# Altium project Auto_OBD.PrjPCB
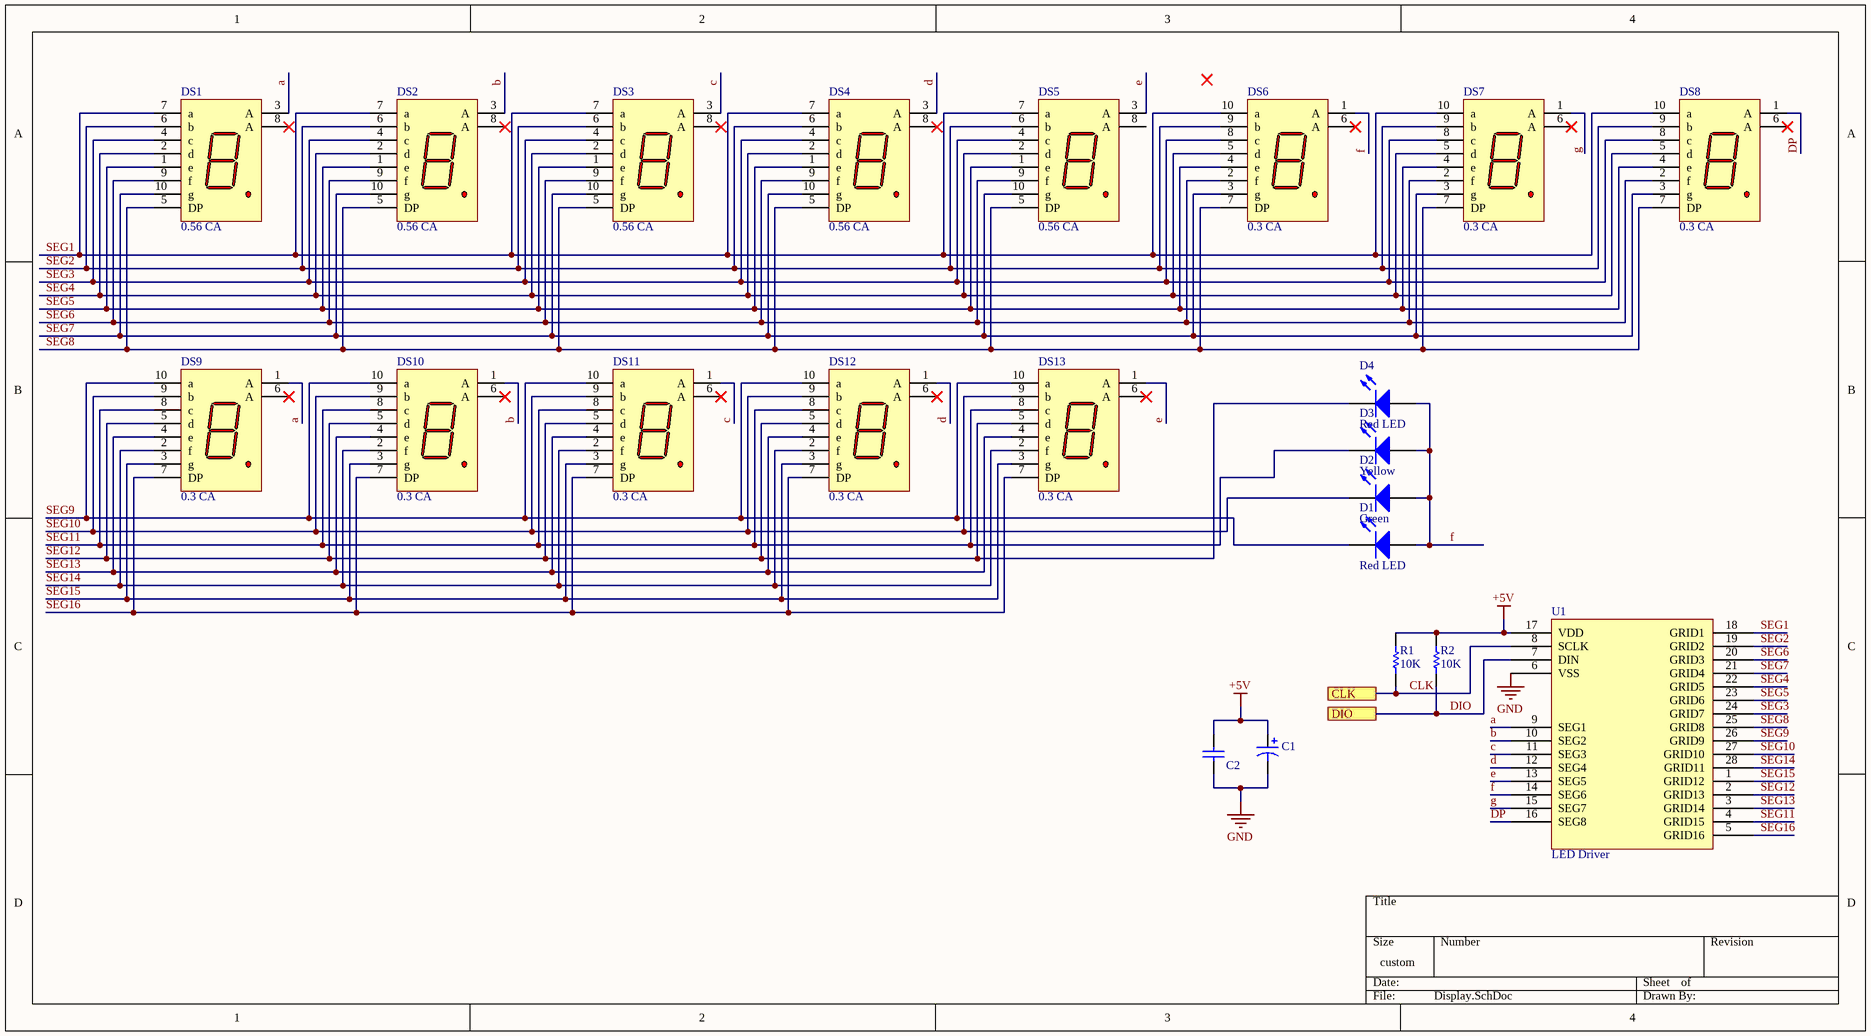
[diagram p0: Display.SchDoc]
2 sheets, 107 parts. Net scope: flat (ports and power ports of the same name join across sheets).
Board files: Auto.PcbDoc, Auto Panel.PcbDoc
Sheets:
  Display.SchDoc
  Auto.SchDoc

## Sheet Display.SchDoc
size 350 x 193 mm; PageSetup: Record=PageOptions|CenterHorizontal=True|CenterVertical=True|PrintScale=0.94|XCorrection=1.00|YCorrection=1.00|PrintKind=1|BorderSize=5000000|LeftOffset=0|BottomOffset=0|Orientation=2|PaperLength=1000|PaperWidth=1000|Scale=100|PaperSource=7|PrintQuality=600|MediaType=1|DitherType=10|PaperKind=Letter|PrintScaleMode=1

### Parts
C1  100uF/16V  [C10uF25V]  (value not drawn)
C2  0.1uF/50V  [C0603]  (value not drawn)
D1  Red LED  [LED-5mm]
D2  Green  [LED-5mm]
D3  Yellow  [LED-5mm]
D4  Red LED  [LED-5mm]
DS1  0.56 CA  [7Segment(0.56)]
DS2  0.56 CA  [7Segment(0.56)]
DS3  0.56 CA  [7Segment(0.56)]
DS4  0.56 CA  [7Segment(0.56)]
DS5  0.56 CA  [7Segment(0.56)]
DS6  0.3 CA  [7Segment(0.36)]
DS7  0.3 CA  [7Segment(0.36)]
DS8  0.3 CA  [7Segment(0.36)]
DS9  0.3 CA  [7Segment(0.36)]
DS10  0.3 CA  [7Segment(0.36)]
DS11  0.3 CA  [7Segment(0.36)]
DS12  0.3 CA  [7Segment(0.36)]
DS13  0.3 CA  [7Segment(0.36)]
R1  10K  [R0603]
R2  10K  [R0603]
U1  LED Driver  [SOP28]

### Ports
CLK, DIO

### Nets
+5V: C1.1 C2.2 R1.2 R2.2 U1.17(VDD)
GND: C1.2 C2.1 U1.6(VSS)
a: DS1.3(A) DS9.1(A) U1.9(SEG1)
b: DS2.3(A) DS10.1(A) U1.10(SEG2)
c: DS3.3(A) DS11.1(A) U1.11(SEG3)
CLK: R1.1 U1.8(SCLK) ; port CLK
d: DS4.3(A) DS12.1(A) U1.12(SEG4)
DIO: R2.1 U1.7(DIN) ; port DIO
DP: DS8.1(A) U1.16(SEG8)
e: DS5.3(A) DS13.1(A) U1.13(SEG5)
f: D1.1(A) D2.1(A) D3.1(A) D4.1(A) DS6.1(A) U1.14(SEG6)
g: DS7.1(A) U1.15(SEG7)
SEG1: DS1.7(a) DS2.7(a) DS3.7(a) DS4.7(a) DS5.7(a) DS6.10(a) DS7.10(a) DS8.10(a) U1.18(GRID1)
SEG2: DS1.6(b) DS2.6(b) DS3.6(b) DS4.6(b) DS5.6(b) DS6.9(b) DS7.9(b) DS8.9(b) U1.19(GRID2)
SEG3: DS1.4(c) DS2.4(c) DS3.4(c) DS4.4(c) DS5.4(c) DS6.8(c) DS7.8(c) DS8.8(c) U1.24(GRID7)
SEG4: DS1.2(d) DS2.2(d) DS3.2(d) DS4.2(d) DS5.2(d) DS6.5(d) DS7.5(d) DS8.5(d) U1.22(GRID5)
SEG5: DS1.1(e) DS2.1(e) DS3.1(e) DS4.1(e) DS5.1(e) DS6.4(e) DS7.4(e) DS8.4(e) U1.23(GRID6)
SEG6: DS1.9(f) DS2.9(f) DS3.9(f) DS4.9(f) DS5.9(f) DS6.2(f) DS7.2(f) DS8.2(f) U1.20(GRID3)
SEG7: DS1.10(g) DS2.10(g) DS3.10(g) DS4.10(g) DS5.10(g) DS6.3(g) DS7.3(g) DS8.3(g) U1.21(GRID4)
SEG8: DS1.5(DP) DS2.5(DP) DS3.5(DP) DS4.5(DP) DS5.5(DP) DS6.7(DP) DS7.7(DP) DS8.7(DP) U1.25(GRID8)
SEG9: D1.2(K) DS9.10(a) DS10.10(a) DS11.10(a) DS12.10(a) DS13.10(a) U1.26(GRID9)
SEG10: D2.2(K) DS9.9(b) DS10.9(b) DS11.9(b) DS12.9(b) DS13.9(b) U1.27(GRID10)
SEG11: D3.2(K) DS9.8(c) DS10.8(c) DS11.8(c) DS12.8(c) DS13.8(c) U1.4(GRID15)
SEG12: D4.2(K) DS9.5(d) DS10.5(d) DS11.5(d) DS12.5(d) DS13.5(d) U1.2(GRID13)
SEG13: DS9.4(e) DS10.4(e) DS11.4(e) DS12.4(e) DS13.4(e) U1.3(GRID14)
SEG14: DS9.2(f) DS10.2(f) DS11.2(f) DS12.2(f) DS13.2(f) U1.28(GRID11)
SEG15: DS9.3(g) DS10.3(g) DS11.3(g) DS12.3(g) DS13.3(g) U1.1(GRID12)
SEG16: DS9.7(DP) DS10.7(DP) DS11.7(DP) DS12.7(DP) DS13.7(DP) U1.5(GRID16)

Not connected (* = marked no-connect by the designer): DS1 8(A)*; DS2 8(A)*; DS3 8(A)*; DS4 8(A)*; DS5 8(A); DS6 6(A)*; DS7 6(A)*; DS8 6(A)*; DS9 6(A)*; DS10 6(A)*; DS11 6(A)*; DS12 6(A)*; DS13 6(A)*

### Library data of the parts
C1 = Capacitor_Electrolytic: 100uF/16V Electrolytic Capacitor; Manufacturer Part Number: Standard; Case/Package: D6xH7; Mount: Yes; Value: 100uF/16V
C2 = Capacitor_Ceramic: CAP CER 0.1UF 50V X7R 0603; Manufacturer Part Number: 0603B104K500CT; Value: 0.1uF/50V; Case/Package: C0603; Mount: Yes
D1 D4 = LED: Red 645nm LED Indication - Discrete 2.1V Radial; Manufacturer Part Number: Standard; Case/Package: 5mm; Mount: Yes; Value: Red LED
D2 = LED: Green 568nm LED Indication - Discrete 2.2V Radial; Manufacturer Part Number: Standard; Case/Package: 5mm; Mount: Yes; Value: Green
D3 = LED: Yellow 585nm LED Indication - Discrete 1.8V Radial; Manufacturer Part Number: Standard; Case/Package: 5mm; Mount: Yes; Value: Yellow
DS1-DS5 = 7 Segment_CA_0.56: DISPLAY 7SEG 0.56" RED 10DIP; Manufacturer Part Number: Standard; Case/Package: 0.56; Mount: Yes; Value: 0.56 CA
DS6-DS13 = 7 Segment_CA_0.36: DISPLAY 7SEG 0.3" RED 10DIP; Manufacturer Part Number: Standard; Case/Package: 0.3"; Mount: Yes; Value: 0.3 CA
R1 R2 = Res1: RES 10K OHM 1% 1/10W 0603; Manufacturer Part Number: CR16-1002-FL; Value: 10K; Case/Package: R0603; Mount: Yes
U1 = TMXXXX: LED Drive Control Circuit; Manufacturer Part Number: TM1640; Case/Package: SOP28; Mount: Yes; Value: LED Driver

## Sheet Auto.SchDoc
size A4
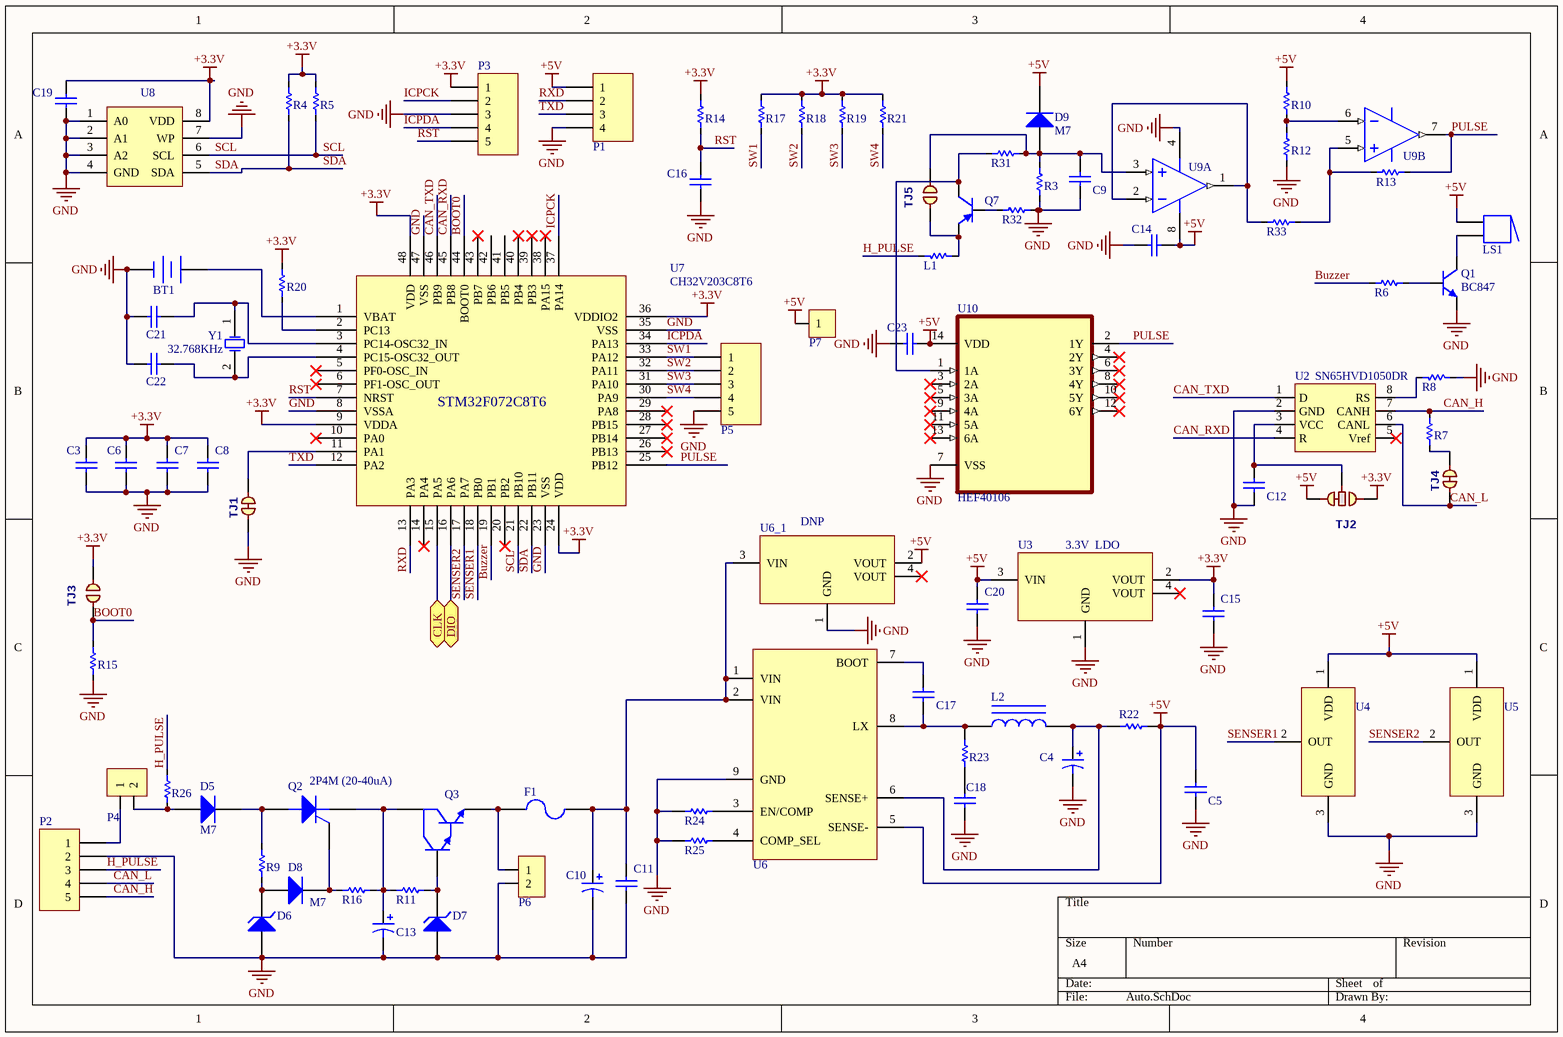
[diagram p1: Auto.SchDoc]

### Parts
BT1  3V  [Battery Holder(CR2032)]  (value not drawn)
C3  0.1uF/50V  [C0603]  (value not drawn)
C4  220uF/16V  [C220uF25V]  (value not drawn)
C5  0.1uF/50V  [C0603]  (value not drawn)
C6  0.1uF/50V  [C0603]  (value not drawn)
C7  0.1uF/50V  [C0603]  (value not drawn)
C8  0.1uF/50V  [C0603]  (value not drawn)
C9  0.1uF/50V  [C0603]  (value not drawn)
C10  1000uF/25V  [C1000uF25V]  (value not drawn)
C11  0.1uF/50V  [C0805]  (value not drawn)
C12  0.1uF/50V  [C0603]  (value not drawn)
C13  1000uF/50V  [C1000uF50V]  (value not drawn)
C14  0.1uF/50V  [C0603]  (value not drawn)
C15  10uF  [C0603]  (value not drawn)
C16  DNP  [C0603]  (value not drawn)
C17  0.1uF/50V  [C0603]  (value not drawn)
C18  3.3nF  [C0603]  (value not drawn)
C19  0.1uF/50V  [C0603]  (value not drawn)
C20  10uF  [C0603]  (value not drawn)
C21  22pF/50V  [C0603]  (value not drawn)
C22  22pF/50V  [C0603]  (value not drawn)
C23  0.1uF/50V  [C0603]  (value not drawn)
D5  M7  [DO-241]
D6  12V/1W  [LL-41]  (value not drawn)
D7  12V/1W  [LL-41]  (value not drawn)
D8  M7  [DO-241]
D9  M7  [SMA]
F1  750mA PTC  [1812(PTC Fuse)]  (value not drawn)
L1  Ferrite Bead  [R0603]  (value not drawn)
L2  22uH/1.8A  [Ferrite_Coil_22uH]  (value not drawn)
LS1  Buzzer  [Buzzer]  (value not drawn)
P1  2515-4  [HDR1X4]  (value not drawn)
P2  Wire Harness  [Connector_508_5pin]  (value not drawn)
P3  5 Pin Header  [HDR1X5]  (value not drawn)
P4  2515-2  [HDR1X2_2515]  (value not drawn)
P5  2515-5  [HDR1X5_2515]  (value not drawn)
P6  2515-2  [HDR1X2_2515]  (value not drawn)
P7  Header 1X1  [HDR1X1]  (value not drawn)
Q1  BC847  [SOT-23]
Q2  2P4M (20-40uA)  [DPAK_SOT423_252]
Q3  MJD122  [DPAK_SOT423_252]  (value not drawn)
Q7  BC857  [SOT-23]  (value not drawn)
R3  10K  [R0603]  (value not drawn)
R4  4.7K  [R0603]  (value not drawn)
R5  4.7K  [R0603]  (value not drawn)
R6  4.7K  [R0603]  (value not drawn)
R7  120R  [R0603]  (value not drawn)
R8  0R  [R0603]  (value not drawn)
R9  1K  [R1206]  (value not drawn)
R10  10K  [R0603]  (value not drawn)
R11  2.2K  [R1206]  (value not drawn)
R12  2.2K  [R0603]  (value not drawn)
R13  100K  [R0603]  (value not drawn)
R14  DNP  [R0603]  (value not drawn)
R15  10K  [R0603]  (value not drawn)
R16  2.2K  [R1206]  (value not drawn)
R17  DNP  [R0603]  (value not drawn)
R18  DNP  [R0603]  (value not drawn)
R19  DNP  [R0603]  (value not drawn)
R20  10K  [R0603]  (value not drawn)
R21  DNP  [R0603]  (value not drawn)
R22  0.062R  [R1210]  (value not drawn)
R23  3R3  [R0603]  (value not drawn)
R24  DNP  [R0603]  (value not drawn)
R25  DNP  [R0603]  (value not drawn)
R26  1K  [R1206]  (value not drawn)
R31  4.7K  [R0603]  (value not drawn)
R32  10K  [R0603]  (value not drawn)
R33  2.2K  [R0603]  (value not drawn)
TJ1  (no value)  [PAD_JUMPER_2_NC]  (no BOM)
TJ2  (no value)  [PAD_JUMPER_3_12NC]  (no BOM)
TJ3  (no value)  [PAD_JUMPER_2_NO]  (no BOM)
TJ4  (no value)  [PAD_JUMPER_2_NC]  (no BOM)
TJ5  JUMPER-PAD-2-NO_BY_TRACE  [PAD_JUMPER_2_NO]  (value not drawn)  (no BOM)
U2  SN65HVD1050DR  [SOIC-8N]
U3  3.3V  LDO  [SOT223]
U4  UHE4913G  [SOT-23 - Sensor]  (value not drawn)
U5  UHE4913G  [SOT-23 - Sensor]  (value not drawn)
U6  uP9602SW8  [SO PowerPAD]  (value not drawn)
U6_1  DNP  [SOT223]
U7  CH32V203C8T6  [TQFP48]
U8  24C02  [SOIC-8N]  (value not drawn)
U9  LM358  [SOIC-8N]  (value not drawn)  (parts A,B of 2)
U10  HEF40106  [SOIC127P600X175-14N]
Y1  32.768KHz  [Craystal_Radial_2x6]

### Ports
CLK (bidir), DIO (bidir)

### Nets
+3.3V: C3.2 C6.2 C7.2 C8.2 C15.2 C19.1 P3.1 R4.2 R5.2 R14.2 R17.2 R18.2 R19.2 R20.2 R21.2 TJ2.3 TJ3.2 U3.2(VOUT) U7.9(VDDA) U7.24(VDD) U7.36(VDDIO2) U7.48(VDD) U8.8(VDD)
+5V: C5.2 C14.2 C20.2 C23.2 D9.2(K) LS1.1 P1.1 P7.1 R10.2 R22.2 TJ2.1 U3.3(VIN) U4.1(VDD) U5.1(VDD) U6.5(SENSE-) U6_1.2(VOUT) U9.8(VCC) U10.14(VDD)
GND: BT1.2(-) C3.1 C4.2 C5.1 C6.1 C7.1 C8.1 C9.2 C10.2 C11.1 C12.1 C13.2 C14.1 C15.1 C16.2 C18.1 C19.2 C20.1 C21.2 C22.2 C23.1 D6.1(A) D7.1(A) P1.4 P2.2 P3.3 P5.5 P6.2 Q1.2(E) R3.2 R8.2 R12.2 R15.2 R24.1 R25.1 R32.1 TJ1.1 U2.2(GND) U3.1(GND) U4.3(GND) U5.3(GND) U6.9(GND) U6_1.1(GND) U7.8(VSSA) U7.23(VSS) U7.35(VSS) U7.47(VSS) U8.1(A0) U8.2(A1) U8.3(A2) U8.4(GND) U8.7(WP) U9.4(GND) U10.7(VSS)
BOOT0: R15.1 TJ3.1 U7.44(BOOT0)
Buzzer: R6.2 U7.19(PB1)
CAN_H: P2.5 R7.2 U2.7(CANH)
CAN_L: P2.4 TJ4.1 U2.6(CANL)
CAN_RXD: U2.4(R) U7.45(PB8)
CAN_TXD: U2.1(D) U7.46(PB9)
CLK: U7.15(PA5) ; port CLK
DIO: U7.16(PA6) ; port DIO
H_PULSE: L1.1 P2.3 R26.2
ICPCK: P3.2 U7.37(PA14)
ICPDA: P3.4 U7.34(PA13)
PULSE: R13.1 U7.25(PB12) U9.7(OUT) U10.2(1Y)
RST: C16.1 P3.5 R14.1 U7.7(NRST)
RXD: P1.2 U7.13(PA3)
SCL: R5.1 U7.21(PB10) U8.6(SCL)
SDA: R4.1 U7.22(PB11) U8.5(SDA)
SENSER1: U4.2(OUT) U7.18(PB0)
SENSER2: U5.2(OUT) U7.17(PA7)
SW1: P5.1 R17.1 U7.33(PA12)
SW2: P5.2 R18.1 U7.32(PA11)
SW3: P5.3 R19.1 U7.31(PA10)
SW4: P5.4 R21.1 U7.30(PA9)
TXD: P1.3 U7.12(PA2)
NetBT1_1: BT1.1(+) U7.1(VBAT)
NetC4_1: C4.1 L2.2 R22.1 U6.6(SENSE+)
NetC9_1: C9.1 D9.1(A) R3.1 R31.1 TJ5.2 U9.3(IN+)
NetC10_1: C10.1 C11.2 F1.2 U6.1(VIN) U6.2(VIN) U6_1.3(VIN)
NetC12_2: C12.2 TJ2.2 U2.3(VCC)
NetC13_1: C13.1 Q2.1(K) Q3.4(C) R11.2 R16.1
NetC17_1: C17.1 U6.7(BOOT)
NetC17_2: C17.2 L2.1 R23.2 U6.8(LX)
NetC18_2: C18.2 R23.1
NetC21_1: C21.1 U7.3(PC14-OSC32_IN) Y1.1(OSC1)
NetC22_1: C22.1 U7.4(PC15-OSC32_OUT) Y1.2(OSC2)
NetD5_1: D5.1(A) P4.2 R26.1
NetD5_2: D5.2(K) Q2.4(A) R9.2
NetD6_2: D6.2(K) D8.1(A) R9.1
NetD7_2: D7.2(K) Q3.1(B) R11.1
NetD8_2: D8.2(K) Q2.3(G) R16.2
NetF1_1: F1.1 P6.1 Q3.3(E)
NetL1_2: L1.2 Q7.2 TJ5.1
NetLS1_2: LS1.2 Q1.3(C)
NetP2_1: P2.1 P4.1
NetQ1_1: Q1.1(B) R6.1
NetQ7_1: Q7.1(B) R32.2
NetQ7_3: Q7.3(C) R31.2 U10.1(1A)
NetR7_1: R7.1 TJ4.1
NetR8_1: R8.1 U2.8(RS)
NetR10_1: R10.1 R12.1 U9.6(IN-)
NetR13_2: R13.2 R33.2 U9.5(IN+)
NetR20_1: R20.1 U7.2(PC13)
NetR24_2: R24.2 U6.3(EN/COMP)
NetR25_2: R25.2 U6.4(COMP_SEL)
NetR33_1: R33.1 U9.1(OUT) U9.2(IN-)
NetTJ1_1: TJ1.1 U7.11(PA1)

Not connected (* = marked no-connect by the designer): U2 5(Vref)*; U3 4(VOUT)*; U6_1 4(VOUT)*; U7 5(PF0-OSC_IN)* 6(PF1-OSC_OUT)* 10(PA0)* 14(PA4)* 20(PB2)* 26(PB13)* 27(PB14)* 28(PB15)* 29(PA8)* 38(PA15)* 39(PB3)* 40(PB4)* 41(PB5) 42(PB6) 43(PB7)*; U10 3(2A)* 4(2Y)* 5(3A)* 6(3Y)* 8(4Y)* 9(4A)* 10(5Y)* 11(5A)* 12(6Y)* 13(6A)*

### Library data of the parts
BT1 = Battery: Cell Battery; Manufacturer Part Number: Standard; Case/Package: CR2032; Mount: Yes; Value: 3V
C3 C5-C9 C11 C12 C14 C17 C19 C23 = Capacitor_Ceramic: as C2 on sheet Display; Value: 0.1uF/50V; Case/Package: C0603; Mount: Yes
C4 = Capacitor_Electrolytic: 220 µF 16 V Aluminum Electrolytic Capacitors Radial; Manufacturer Part Number: Standard; Case/Package: D6xH12; Mount: Yes; Value: 220uF/16V
C10 = Capacitor_Electrolytic: CAP ALUM 1000UF 20% 25V RADIAL; Manufacturer Part Number: Standard; Case/Package: D10xH17; Mount: Yes; Value: 1000uF/25V
C13 = Capacitor_Electrolytic: CAP ALUM 1000UF 20% 35V RADIAL; Manufacturer Part Number: Standard; Case/Package: D13xH25; Mount: Yes; Value: 1000uF/50V
C15 C20 = Capacitor_Ceramic: CAP CER 10UF 10V X5R 0603; Manufacturer Part Number: CL10A106MP8NNNC; Value: 10uF; Case/Package: C0603; Mount: Yes
C16 = Capacitor_Ceramic: Mount: No; Value: DNP; Case/Package: C0603; Manufacturer Part Number: DNP
C18 = Capacitor_Ceramic: CAP CER 3300PF 50V X7R 0603; Manufacturer Part Number: CC0603KRX7R9BB332; Case/Package: C0603; Mount: Yes; Value: 3.3nF
C21 C22 = Capacitor_Ceramic: CAP CER 22PF 50V C0G/NPO 0603; Manufacturer Part Number: CC0603JRNPO9BN220; Value: 22pF/50V; Case/Package: C0603; Mount: Yes
D5 D8 D9 = Diode: General Purpose Diode; Case/Package: SMA; Manufacturer Part Number: M7; Mount: Yes; Value: M7
D6 D7 = D Zener: Zener Diode; Manufacturer Part Number: SML4742A-E3/61; Case/Package: SMA; Mount: Yes; Value: 12V/1W
F1 = Fuse: PTC RESET FUSE 24V 750MA 1812; Manufacturer Part Number: WT-1812-075; Case/Package: 1812; Mount: Yes; Value: 750mA PTC
L1 = Res1: Ferrite Bead  200mΩ ±25% 60Ω@100MHz; Manufacturer Part Number: FCM1608KF-600T07; Value: Ferrite Bead; Case/Package: R0603; Mount: Yes
L2 = Ferrite_Coil: FIXED IND 22UH 1.8A 116MOHM SMD; Manufacturer Part Number: SWPA6045S220MT; Case/Package: 6x6x4.5; Mount: Yes; Value: 22uH/1.8A
LS1 = Buzzer: Magnetic Transducer Buzzer; Manufacturer Part Number: Standard; Case/Package: D12xH10; Mount: Yes; Value: Buzzer
P1 = Header 4: Header, 4-Pin; Manufacturer Part Number: Standard; Case/Package: HDR1x4; Mount: Yes; Value: 2515-4
P2 = Header 5: Header, 5-Pin; Manufacturer Part Number: Custom; Case/Package: Custom; Mount: Yes; Value: Wire Harness
P3 = Header 5: Header, 5-Pin; Manufacturer Part Number: Standard; Mount: No; Case/Package: HDR1x5; Value: 5 Pin Header
P4 = Header 2X1: Manufacturer Part Number: Standard; Case/Package: 2515-2; Mount: Yes; Value: 2515-2
P5 = Header 5: Header, 5-Pin; Manufacturer Part Number: DNP; Mount: No; Case/Package: 2515-5; Value: 2515-5
P6 = Header 2X1: Manufacturer Part Number: DNP; Mount: No; Case/Package: 2515-2; Value: 2515-2
Q1 = NPN: TRANS NPN 45V 0.1A SOT-23-3; Case/Package: SOT-23; Mount: Yes; Value: BC847; Manufacturer Part Number: BC847
Q2 = SCR: THYRISTOR, P-GATE,  2A,  400V; Case/Package: TO252; Manufacturer Part Number: 2P4M; Mount: Yes; Value: 2P4M (20-40uA)
Q3 = NPN1: TRANS NPN DARL 100V 8A TO-252-2L; Case/Package: TO252; Manufacturer Part Number: MJD122; Mount: Yes; Value: MJD122
Q7 = PNP: TRANS PNP 45V 0.1A SOT23-3; Case/Package: SOT-23; Manufacturer Part Number: BC857; Mount: Yes; Value: BC857
R3 R10 R15 R20 R32 = Res1: as R1 on sheet Display; Value: 10K; Case/Package: R0603; Mount: Yes
R4-R6 R31 = Res1: RES 4.7K OHM 1% 1/10W 0603; Manufacturer Part Number: CR16-4701-FL; Value: 4.7K; Case/Package: R0603; Mount: Yes
R7 = Res1: RES 120 OHM 1% 1/10W 0603; Manufacturer Part Number: RC0603FR-07120RL; Value: 120R; Case/Package: R0603
R8 = Res1: RES 0 OHM 1% 1/10W 0603; Manufacturer Part Number: RC0603FR-070RL; Value: 0R; Case/Package: R0603; Mount: Yes
R9 R26 = Res1: Resistor; Manufacturer Part Number: RC1206JR-071KL; Value: 1K; Case/Package: R1206; Mount: Yes
R11 R16 = Res1: RES 2.2K OHM 1% 1/4W 1206; Manufacturer Part Number: CR32-2201-FL; Value: 2.2K; Case/Package: R1206; Mount: Yes
R12 R33 = Res1: RES 2.2K OHM 1% 1/10W 0603; Manufacturer Part Number: RC0603JR-072K2L; Value: 2.2K; Case/Package: R0603; Mount: Yes
R13 = Res1: RES 100K OHM 1% 1/4W 0603; Manufacturer Part Number: CR-03JTP-100KR; Value: 100K; Case/Package: R0603; Mount: Yes
R14 R17-R19 R21 R24 R25 = Res1: Resistor; Mount: No; Value: DNP; Case/Package: R0603; Manufacturer Part Number: DNP
R22 = Res1: RES 0.062 OHM 2/3W 1% 1210; Manufacturer Part Number: RL2110FR-070R062L; Value: 0.062R; Case/Package: R1210; Mount: Yes
R23 = Res1: RES 3.3 OHM 1% 1/10W 0603; Manufacturer Part Number: RC0603FR-073R3L; Value: 3R3; Case/Package: R0603; Mount: Yes
TJ1 TJ4 = JUMPER-PAD-2-NC_BY_TRACE
TJ2 = JUMPER-PAD-3-1OF2_NC_BY_TRACE_SMALL
TJ3 = JUMPER-PAD-2-NO_BY_TRACE
U2 = SN65HVD230: IC TRANSCEIVER HALF 1/1 8SOIC; Case/Package: SOIC-8; Manufacturer Part Number: SN65HVD1050DR; Mount: Yes; Value: SN65HVD1050DR
U3 = LM1117: IC REG LINEAR 3.3V 1A SOT-223; Manufacturer Part Number: LD1117AG-33-AA3-A-R; Case/Package: SOT-223; Mount: Yes; Value: 3.3V  LDO
U4 U5 = AH1802: Digital Switch Omnipolar Hall Effect SOT-23; Manufacturer Part Number: UHE4913G-AE3-R; Case/Package: SOT-23; Mount: Yes; Value: UHE4913G
U6 = uP9601T: DC-to-DC Converter Control Circuit; Case/Package: SOIC-8; Manufacturer Part Number: uP9602SW8; Mount: Yes; Value: uP9602SW8
U6_1 = LM1117: Mount: No; Case/Package: SOT-223; Manufacturer Part Number: DNP; Value: DNP
U7 = STM32F072C8T6: 64K Flash value RISC MCU.  12-bit ADC, DMA, TIM, USART, I2C, SPI, and so on.; Case/Package: TQFP48; Manufacturer Part Number: CH32V203C8T6; Mount: Yes; Value: CH32V203C8T6
U8 = 24Cxx: IC EEPROM 2KBIT I2C 400KHZ 8SOIC; Manufacturer Part Number: FT24C02A-KSR-T; Case/Package: SOIC-8; Mount: Yes; Value: 24C02
U9 = LM158: IC OPAMP GP 2 CIRCUIT 8SOIC; Manufacturer Part Number: LM358DT; Case/Package: SOIC-8; Mount: Yes; Value: LM358
U10 = HEF40106BT: IC INVERT SCHMITT 6CH 1-INP 14SO; Mount: DNP; Value: HEF40106; Case/Package: SOIC-14; Manufacturer Part Number: HEF40106BT
Y1 = XTAL: Crystal 32.768kHz ±10ppm 12.5pF 40kΩ DT-26; Manufacturer Part Number: TAXD32768K2BGBBZT2S; Case/Package: DT-26; Mount: Yes; Value: 32.768KHz

## Nets that join several sheets
+5V: Display (5 pins), Auto (18 pins)
GND: Display (C1.2 C2.1 U1.6), Auto (54 pins)
CLK: Display (R1.1 U1.8), Auto (U7.15)
DIO: Display (R2.1 U1.7), Auto (U7.16)